# Altium project GATEWAY.PrjPcb
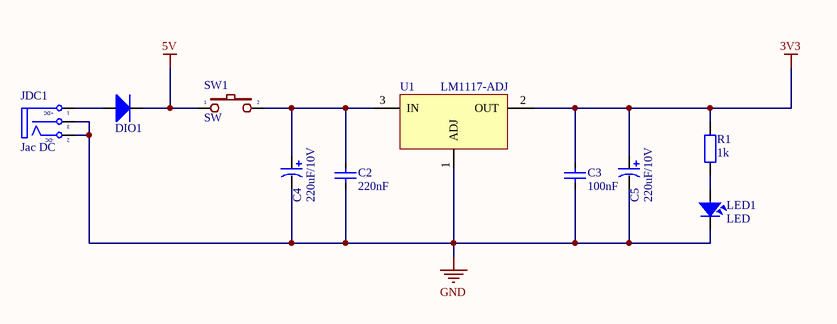
[diagram p0: POWER.SchDoc]
2 sheets, 41 parts. Net scope: global (net labels, ports and power ports of the same name join across sheets).
Board file: Main.PcbDoc
Sheets:
  POWER.SchDoc
  Main.SchDoc

## Sheet POWER.SchDoc
size A; SheetNumber: 1; SheetTotal: 2

### Parts
(Parts that share a designator on the sheet are numbered #1, #2 ... from top to bottom, then left to right.)
C2  220nF  [CAP_0805]
C3  100nF  [CAP_0805]
C4  220uF/10V  [CAP_7343]
C5#1  220uF/10V  [CAP_7343]
DIO1  Diode SMD  [DIO-214AC(SMA)]  (value not drawn)
JDC1  Jac DC  [DC-IN]
LED1  LED  [LED-0805-Red]
R1  1k  [RES-SMD-0805]
SW1  SW  [SW2]
U1  LM1117-ADJ  [LM1117-SOP]

### Nets
3V3: C3.2 C5#1.1 R1.1 U1.2(OUT)
5V: DIO1.2(K) SW1.1
GND: C2.1 C3.1 C4.2 C5#1.2 JDC1.2(TN) JDC1.3(S) LED1.2 U1.1(ADJ)
NetC2_2: C2.2 C4.1 SW1.2 U1.3(IN)
NetDIO1_1: DIO1.1(A) JDC1.1(T)
NetLED1_1: LED1.1 R1.2

### Notes on the sheet
- (in symbol DCIN) +DC; -DC

### Library data of the parts
C2 C3 = CapSMD: Capacitor; Value: 33p; Published: 8-Jun-2000; LatestRevisionDate: 17-Jul-2002; LatestRevisionNote: Re-released for DXP Platform.; PackageReference: RAD-0.3; Publisher: Altium Limited
C4 C5#1 = CAP_TAN_SMD: Polazied Tantalum Capacitor
DIO1 = Diode SMD: Default Diode; Code - JEDEC: DO-214-AB; Value: 1N5007; Published: 8-Jun-2000; Revision: July-2002: Re-released for DXP Platform.; Publisher: Altium Limited
JDC1 = DCIN: Jac DC input; Value: Jac DC
LED1 = LED: LED Single colour Green and Red; Value: LED 3 ly Single Colour
R1 = Resistor - SMD: Resistor SMD; Manufacturer: Generic Components; Class: Passive; Published: 08/06/2000; Publisher: Altium Hobart Technology Centre
SW1 = SW2: Switch button 2 pin; Value: SW chip 2 pin
U1 = LM1117-ADJ: 800mA Low-Dropout Linear Regulator; Creator: Nguyen Ba Bien; Website: http://group3i.net

## Sheet Main.SchDoc
size B; SheetNumber: 2; SheetTotal: 2
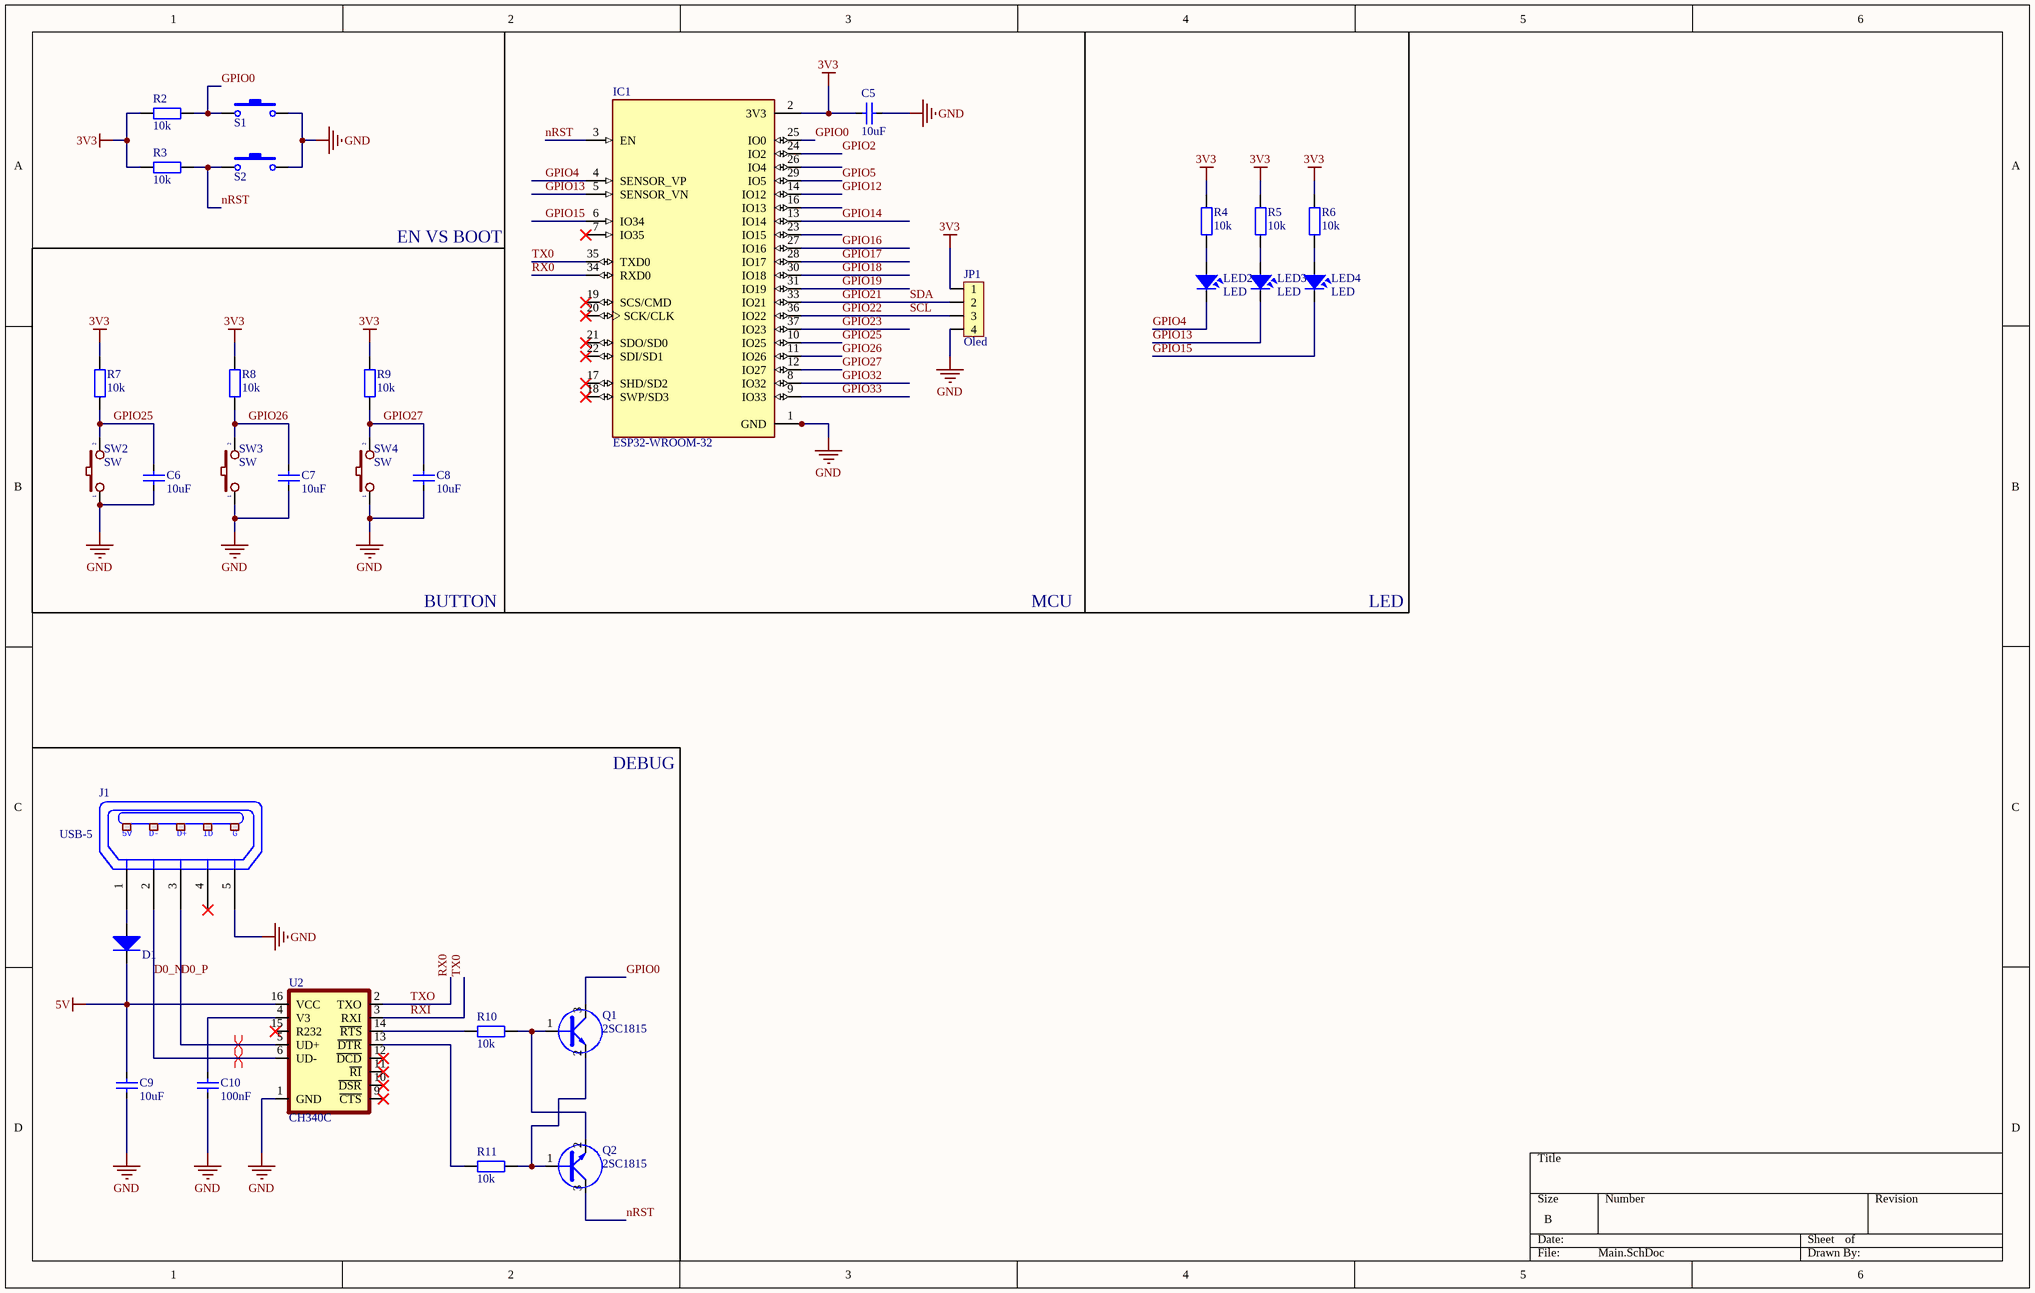
[diagram p1: Main.SchDoc]

### Parts
(Parts that share a designator on the sheet are numbered #1, #2 ... from top to bottom, then left to right.)
C5#2  10uF  [CAP_0805]
C6  10uF  [CAP_0805]
C7  10uF  [CAP_0805]
C8  10uF  [CAP_0805]
C9  10uF  [CAP_0805]
C10  100nF  [CAP_0805]
D1  Diode SMD  [DIO-214AC(SMA)]  (value not drawn)
IC1  ESP32-WROOM-32  [MODULE_ESP32-WROOM-32]
J1  USB-5  [USB-M1]
JP1  Oled  [JP4-C1T]
LED2  LED  [LED-0805-Orange]
LED3  LED  [LED-0805-Orange]
LED4  LED  [LED-0805-Orange]
Q1  2SC1815  [SOT23D]
Q2  2SC1815  [SOT23D]
R2  10k  [RES-SMD-0805]
R3  10k  [RES-SMD-0805]
R4  10k  [RES-SMD-0805]
R5  10k  [RES-SMD-0805]
R6  10k  [RES-SMD-0805]
R7  10k  [RES-SMD-0805]
R8  10k  [RES-SMD-0805]
R9  10k  [RES-SMD-0805]
R10  10k  [RES-SMD-0805]
R11  10k  [RES-SMD-0805]
S1  SW-SMD  [SW 3x2x4]  (value not drawn)
S2  SW-SMD  [SW 3x2x4]  (value not drawn)
SW2  SW  [SW2]
SW3  SW  [SW2]
SW4  SW  [SW2]
U2  CH340C  [SOP-16]

### Nets
3V3: C5#2.2 IC1.2(3V3) JP1.1 R2.2 R3.2 R4.1 R5.1 R6.1 R7.1 R8.1 R9.1
5V: C9.2 D1.2(K) U2.16(VCC)
GND: C5#2.1 C6.1 C7.1 C8.1 C9.1 C10.1 IC1.1(GND) IC1.15(GND) IC1.38(GND) IC1.39_1(GND) IC1.39_2(GND) IC1.39_3(GND) IC1.39_4(GND) IC1.39_5(GND) IC1.39_6(GND) IC1.39_7(GND) IC1.39_8(GND) IC1.39_9(GND) IC1.39_10(GND) IC1.39_11(GND) IC1.39_12(GND) IC1.39_13(GND) IC1.39_14(GND) IC1.39_15(GND) IC1.39_16(GND) IC1.39_17(GND) IC1.39_18(GND) IC1.39_19(GND) IC1.39_20(GND) IC1.39_21(GND) J1.5(P5) JP1.4 S1.2 S2.2 SW2.1 SW3.1 SW4.1 U2.1(GND)
D0_N: J1.2(P2) U2.6(UD-)
D0_P: J1.3(P3) U2.5(UD+)
GPIO0: IC1.25(IO0) Q1.3(C) R2.1 S1.1
GPIO2: IC1.24(IO2)
GPIO4: IC1.4(SENSOR_VP) LED2.2
GPIO5: IC1.29(IO5)
GPIO12: IC1.14(IO12)
GPIO13: IC1.5(SENSOR_VN) LED3.2
GPIO14: IC1.13(IO14)
GPIO15: IC1.6(IO34) LED4.2
GPIO16: IC1.27(IO16)
GPIO17: IC1.28(IO17)
GPIO18: IC1.30(IO18)
GPIO19: IC1.31(IO19)
GPIO21: IC1.33(IO21) JP1.2  [also labelled SDA]
GPIO22: IC1.36(IO22) JP1.3  [also labelled SCL]
GPIO23: IC1.37(IO23)
GPIO25: C6.2 IC1.10(IO25) R7.2 SW2.2
GPIO26: C7.2 IC1.11(IO26) R8.2 SW3.2
GPIO27: C8.2 IC1.12(IO27) R9.2 SW4.2
GPIO32: IC1.8(IO32)
GPIO33: IC1.9(IO33)
nRST: IC1.3(EN) Q2.3(C) R3.1 S2.1
RX0: IC1.34(RXD0) U2.2(TXO)  [also labelled TXO]
RXI: IC1.35(TXD0) U2.3(RXI)  [also labelled TX0]
NetC10_2: C10.2 U2.4(V3)
NetD1_1: D1.1(A) J1.1(P1)
NetLED2_1: LED2.1 R4.2
NetLED3_1: LED3.1 R5.2
NetLED4_1: LED4.1 R6.2
NetQ1_1: Q1.1(B) Q2.2(E) R10.1
NetQ1_2: Q1.2(E) Q2.1(B) R11.1
NetR10_2: R10.2 U2.14(~{RTS})
NetR11_2: R11.2 U2.13(~{DTR})

Not connected (* = marked no-connect by the designer): IC1 7(IO35)* 16(IO13) 17(SHD/SD2)* 18(SWP/SD3)* 19(SCS/CMD)* 20(SCK/CLK)* 21(SDO/SD0)* 22(SDI/SD1)* 23(IO15) 26(IO4); J1 4(P4)*; U2 9(~{CTS})* 10(~{DSR})* 11(~{RI})* 12(~{DCD})* 15(R232)*

### Layout directives
differential pair: D0_N, D0_P

### Notes on the sheet
- EN VS BOOT
- BUTTON
- MCU
- LED
- DEBUG
- (in symbol USB-5) 5V; D-; D+; ID; G

### Library data of the parts
C5#2 C6-C10 = CapSMD: Capacitor; Value: 33p; Published: 8-Jun-2000; LatestRevisionDate: 17-Jul-2002; LatestRevisionNote: Re-released for DXP Platform.; PackageReference: RAD-0.3; Publisher: Altium Limited
D1 = Diode SMD: as DIO1 on sheet POWER; Published: 8-Jun-2000; Revision: July-2002: Re-released for DXP Platform.; Publisher: Altium Limited
IC1 = ESP32-WROOM-32: Bluetooth, WiFi Transceiver Module 2.4GHz ~ 2.5GHz Surface Mount; MF: Espressif Systems; Package: Module Espressif Systems; Digi-Key_Part_Number: 1904-1010-1-ND; Digi-Key_Purchase_URL: https://www.digikey.com/product-detail/en/espressif-systems/ESP32-WROOM-32/1904-1010-1-ND/8544305?utm_source=snapeda&utm_medium=aggregator&utm_campaign=symbol; Value: *; MP: ESP32-WROOM-32; SnapEDA_Link: https://www.snapeda.com/parts/ESP32-WROOM-32/Espressif%20Systems/view-part/2753322/?ref=snap
J1 = USB-5: Manufacturer: FCI; Manufacturer Part Number: 10118193-0001LF; Connector Type: USB - micro B; Number of Contacts: 5; Gender: Receptacle; Specifications: USB 2.0; .Creator: MM; .Checked PCB: RF; Supplier 1: Digi-Key; RoHS: RoHS Compliant; Category: Connectors, Interconnects; Stock 1: 28642; Pricing 1: 1=0.46, 10=0.433, 25=0.3712, 50=0.3156, 100=0.3032, 250=0.27224, 500=0.25988 (USD); Packaging: Cut Tape (CT); Mounting Type: Surface Mount, Right Angle, Horizontal; Features: Shielded, Solder Retention; Ingress Protection: -; ComponentLink1URL: http://portal.fciconnect.com/Comergent//fci/drawing/10118193.pdf; ComponentLink1Description: http://portal.fciconnect.com/Comergent//fci/drawing/10118193.pdf; Supplier Part Number 1: 609-4616-1-ND; .Checked SCH: MM
JP1 = JP4: WR-PHD 2.54 mm Angled Socket Header; Manufacturer: W¨¹rth Elektronik eiSos GmbH; partNo: 613004143121; ComponentLink1 Description: Manufacturer; ComponentLink2 Description: Datasheet; NoPins: 04; Created Date: 29 March 2013; ComponentLink1URL: http://www.we-online.com; ComponentLink2URL: http://katalog.we-online.de/em/datasheet/6130xx143121.pdf; Created by: Karrer Zheng
LED2-LED4 = LED: as LED1 on sheet POWER
Q1 Q2 = C1815: NPN 600mW, ECB; Value: C1815
R2-R11 = Resistor - SMD: as R1 on sheet POWER; Published: 08/06/2000; Publisher: Altium Hobart Technology Centre
S1 S2 = SW-SMD: Switch; Published: 24-Mar-1999; LatestRevisionDate: 17-Jul-2002; LatestRevisionNote: Re-released for DXP Platform.; PackageReference: SPST-2; Publisher: Altium Limited
SW2-SW4 = SW2: as SW1 on sheet POWER
U2 = CH340C: USB to serial chip CH340; MF: WCH; Package: Package; Check_prices: https://www.snapeda.com/parts/CH340C/WCH/view-part/5428851/?ref=eda; Value: *; Price: None; MP: CH340C; Availability: Unavailable; SnapEDA_Link: https://www.snapeda.com/parts/CH340C/WCH/view-part/5428851/?ref=snap

## Nets that join several sheets
3V3: POWER (C3.2 C5#1.1 R1.1 U1.2), Main (11 pins)
5V: POWER (DIO1.2 SW1.1), Main (C9.2 D1.2 U2.16)
GND: POWER (8 pins), Main (38 pins)